# Altium schematic sheet GDRIVE1.SchDoc
size A3; PageSetup: Record=PageOptions|CenterHorizontal=True|CenterVertical=True|PrintScale=1.00|XCorrection=1.00|YCorrection=1.00|PrintKind=1|BorderSize=5000000|LeftOffset=0|BottomOffset=0|Orientation=2|PaperLength=1000|PaperWidth=1000|Scale=100|PaperSource=7|PrintQuality=-3|MediaType=1|DitherType=10|PrintScaleMode=1|PaperKind=A3|PaperIndex=8
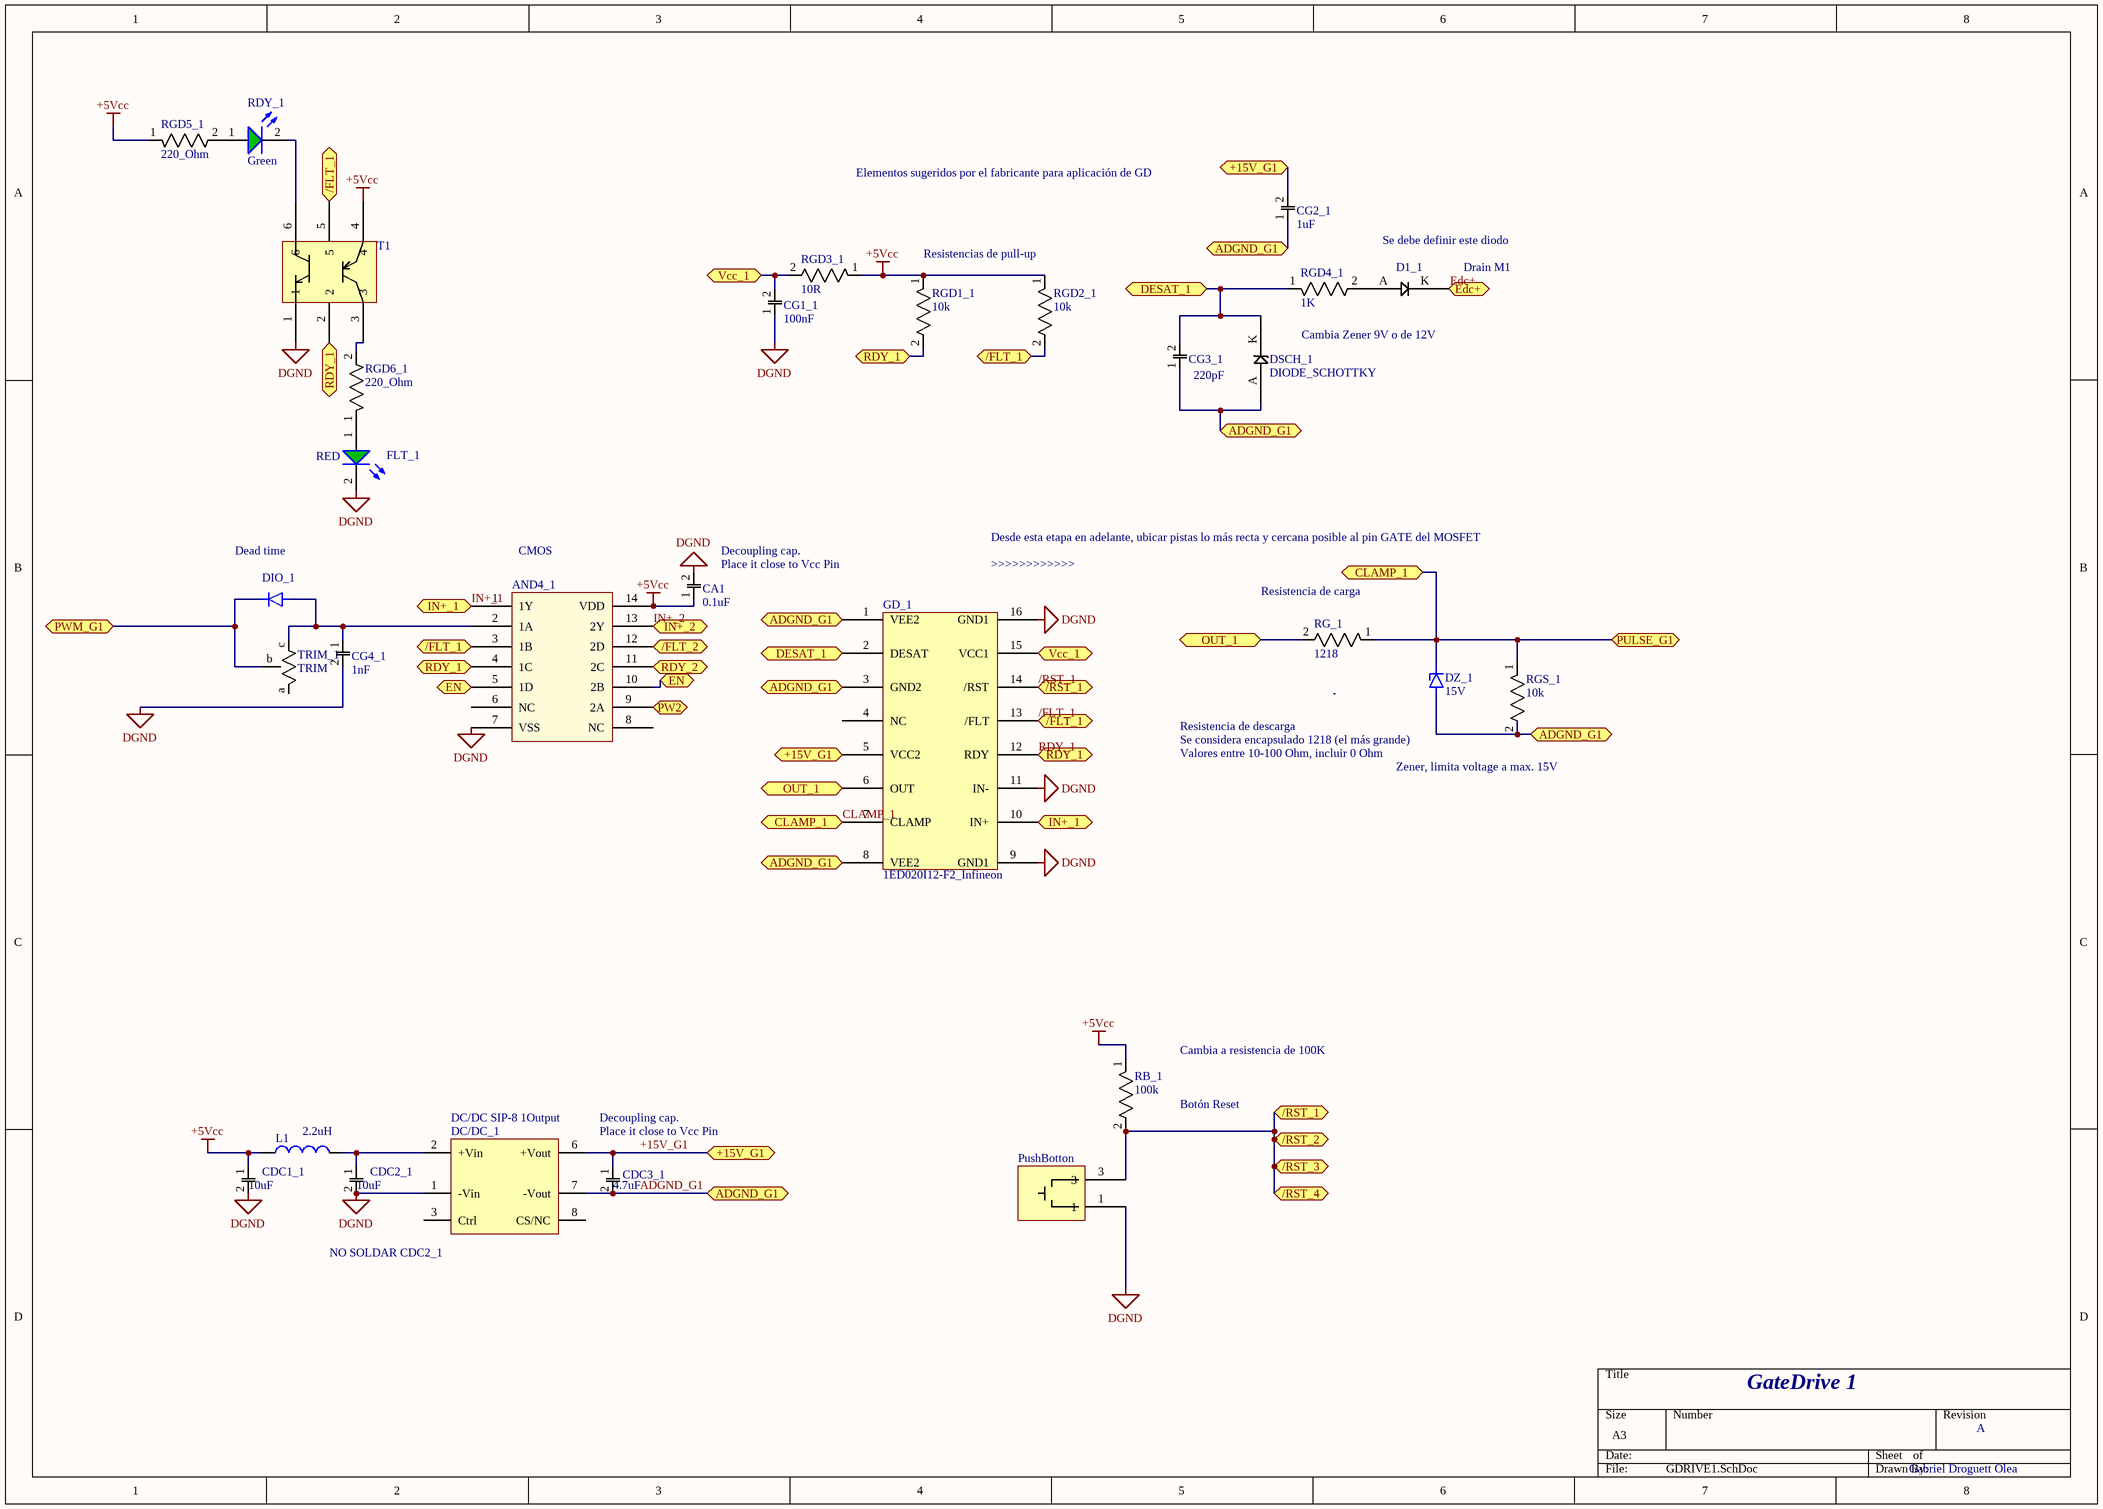
[diagram p0: GDRIVE1.SchDoc]

## Parts
AND4_1  AND_4_2  [SOIC-14]  (value not drawn)
CA1  0.1uF  [CAP_0603]
CDC1_1  10uF  [C1206]
CDC2_1  10uF  [C1206]
CDC3_1  4.7uF  [C1206]
CG1_1  100nF  [CAP_0805_L]
CG2_1  1uF  [CAP_0603]
CG3_1  220pF  [CAP_0603]
CG4_1  1nF  [CAP_0805]
D1_1  DIODE  [DO-214AC]  (value not drawn)
DC/DC_1  DC/DC SIP-8 1Output  [DC/DC SIP-8]
DIO_1  DIOde  [DIO_BAS85-GS08]  (value not drawn)
DSCH_1  DIODE_SCHOTTKY  [SOD323W]
DZ_1  15V  [BZV55-C15,115]
FLT_1  RED  [LED_0805]
GD_1  1ED020I12-F2_Infineon  [SOIC_16W]
L1  2.2uH  [RES_0805]
PushBotton  SWITCH PUSH SPST-NO  [SWITCH PUSH SPST-NO]  (value not drawn)
RB_1  100k  [0603]
RDY_1  Green  [LED_0805]
RG_1  1218  [RES_1218]
RGD1_1  10k  [0603]
RGD2_1  10k  [0603]
RGD3_1  10R  [RES_1206]
RGD4_1  1K  [RES_0805]
RGD5_1  220_Ohm  [res_0805]
RGD6_1  220_Ohm  [res_0805]
RGS_1  10k  [RES_1206]
T1  TRANS PREBIAS  [SOT363_]  (value not drawn)
TRIM_1  TRIM  [TRIM_TS53YJ203MR10]

## Ports
+15V_G1 (bidir), /FLT_1 (bidir), /FLT_2 (bidir), /RST_1 (bidir), /RST_2 (bidir), /RST_3 (bidir), /RST_4 (bidir), ADGND_G1 (bidir), CLAMP_1 (bidir), DESAT_1 (bidir), Edc+ (bidir), EN (bidir), IN+_1 (bidir), IN+_2 (bidir), OUT_1 (bidir), PULSE_G1 (bidir), PW2 (bidir), PWM_G1 (bidir), RDY_1 (bidir), RDY_2 (bidir), Vcc_1 (bidir)

## Nets
+5Vcc: AND4_1.14(VDD) CA1.1 CDC1_1.1 L1.1 RB_1.1(C) RGD1_1.1(C) RGD2_1.1(C) RGD3_1.1(C) RGD5_1.1(C) T1.4
DGND: AND4_1.7(VSS) CA1.2 CDC1_1.2 CDC2_1.2 CG1_1.1 CG4_1.2 DC/DC_1.1(-Vin) FLT_1.2(C) GD_1.9(GND1) GD_1.11(IN-) GD_1.16(GND1) PushBotton.1 T1.1
+15V_G1: CDC3_1.1 CG2_1.2 DC/DC_1.6(+Vout) GD_1.5(VCC2) ; port +15V_G1
/FLT_1: AND4_1.3(1B) GD_1.13(/FLT) RGD2_1.2(A) T1.5 ; port /FLT_1
/FLT_2: AND4_1.12(2D) ; port /FLT_2
/RST_1: GD_1.14(/RST) PushBotton.3 RB_1.2(A) ; port /RST_1, port /RST_2, port /RST_3, port /RST_4
ADGND_G1: CDC3_1.2 CG2_1.1 CG3_1.1 DC/DC_1.7(-Vout) DSCH_1.A DZ_1.2(Anodo) GD_1.1(VEE2) GD_1.3(GND2) GD_1.8(VEE2) RGS_1.2(A) ; port ADGND_G1
CLAMP_1: DZ_1.1(Catodo) GD_1.7(CLAMP) RG_1.1(C) RGS_1.1(C) ; port CLAMP_1, port PULSE_G1
DESAT_1: CG3_1.2 DSCH_1.K GD_1.2(DESAT) RGD4_1.1(C) ; port DESAT_1
Edc+: D1_1.K ; port Edc+
EN: AND4_1.5(1D) AND4_1.10(2B) ; port EN
IN+_1: AND4_1.1(1Y) GD_1.10(IN+) ; port IN+_1
IN+_2: AND4_1.13(2Y) ; port IN+_2
OUT_1: GD_1.6(OUT) RG_1.2(A) ; port OUT_1
PW2: AND4_1.9(2A) ; port PW2
PWM_G1: DIO_1.1(Catodo) TRIM_1.b ; port PWM_G1
RDY_1: AND4_1.4(1C) GD_1.12(RDY) RGD1_1.2(A) T1.2 ; port RDY_1
RDY_2: AND4_1.11(2C) ; port RDY_2
Vcc_1: CG1_1.2 GD_1.15(VCC1) RGD3_1.2(A) ; port Vcc_1
NetAND4_1_2: AND4_1.2(1A) CG4_1.1 DIO_1.2(Anodo) TRIM_1.c
NetCDC2_1_1: CDC2_1.1 DC/DC_1.2(+Vin) L1.2
NetD1_1_A: D1_1.A RGD4_1.2(A)
NetFLT_1_1: FLT_1.1(A) RGD6_1.1(C)
NetRDY_1_1: RDY_1.1(A) RGD5_1.2(A)
NetRDY_1_2: RDY_1.2(C) T1.6
NetRGD6_1_2: RGD6_1.2(A) T1.3

Not connected (* = marked no-connect by the designer): AND4_1 6(NC) 8(NC); DC/DC_1 3(Ctrl) 8(CS/NC); GD_1 4(NC); TRIM_1 a

## Notes on the sheet
- Elementos sugeridos por el fabricante para aplicación de GD
- Se debe definir este diodo
- Resistencias de pull-up
- Drain M1
- Cambia Zener 9V o de 12V
- (near DIO_1) Dead time
- (near AND4_1) CMOS
- (near CA1) Decoupling cap.
- Place it close to Vcc Pin
- Desde esta etapa en adelante, ubicar pistas lo más recta y cercana posible al pin GATE del MOSFET
- (near GD_1) >>>>>>>>>>>>
- (near RG_1) Resistencia de carga
- Resistencia de descarga
- Se considera encapsulado 1218 (el más grande)
- Valores entre 10-100 Ohm, incluir 0 Ohm
- (near RGS_1) Zener, limita voltage a max. 15V
- Cambia a resistencia de 100K
- Decoupling cap.
- Botón Reset
- (near DC/DC_1) NO SOLDAR CDC2_1
- GateDrive 1
- A
- Gabriel Droguett Olea
- Labels drawn without touching a wire or pin: Edc+

## Library data of the parts
AND4_1 = AND_4_2: IC GATE AND 2CH 4-INP 14-SO; Manufacturer Part Number: HEF4082BT,653; Digi-Key Part Number: 1727-6011-1-ND; RS Part Number: *
CA1 = CAP_0603YC104KAT2A: 0.1µF ±10% 16V Ceramic Capacitor X7R 0603 (1608 Metric); Digi-Key Part Number: 478-1239-1-ND; Manufacturer Part Number: 0603YC104KAT2A; RS Part Number: *
CDC1_1 CDC2_1 = CAP_C0805C105Z3VACTU: CAP CER 10UF 35V X6S 1206; Manufacturer Part Number: C3216X6S1V106K160AC; Digi-Key Part Number: 445-14778-1-ND; RS Part Number: 723-6647
CDC3_1 = CAP_C0805C105Z3VACTU: CAP CER 4.7UF 35V X7R 1206; Manufacturer Part Number: C3216X7R1V475K085AC; Digi-Key Part Number: 445-14805-1-ND; RS Part Number: *
CG1_1 = CAP_0603YC104KAT2A: CAP CER 0.1UF 50V X7R 0805; Manufacturer Part Number: 08055C104KAT2A; Digi-Key Part Number: 478-1395-1-ND; RS Part Number: *
CG2_1 = CAP_0603YC104KAT2A: CAP CER 1UF 50V X5R 0603; Manufacturer Part Number: CGA3E3X5R1H105K080AB; Digi-Key Part Number: 445-7878-1-ND; RS Part Number: *
CG3_1 = CAP_0603YC104KAT2A: CAP CER 220PF 50V C0G/NP0 0603; Manufacturer Part Number: C0603C221F5GACTU; Digi-Key Part Number: 399-7876-1-ND; RS Part Number: *
CG4_1 = CAP_C0805C102J5GACTU: CAP CER 1000PF 50V C0G/NP0 0805; Digi-Key Part Number: 399-1136-1-ND; Manufacturer Part Number: C0805C102J5GACTU; RS Part Number: *
D1_1 = DIODE: DIODE GEN PURP 1KV 1A SMA; Manufacturer Part Number: RS1MTR; Digi-Key Part Number: 1655-1501-1-ND; RS Part Number: *
DIO_1 = DIO_BAS85-GS08: DIODE SCHOTTKY 30V 200MA SOD80; Digi-Key Part Number: BAS85-GS08CT-ND; Manufacturer Part Number: BAS85-GS08; RS Part Number: *
DSCH_1 = DIODE_SCHOTTKY: DIODE SCHOTTKY 30V 200MA SOT23-3; Manufacturer Part Number: BAT54-7-F; Digi-Key Part Number: BAT54-FDICT-ND; RS Part Number: *
DZ_1 = DIO_BZV55-C15,115: DIODE ZENER 15V 500MW SOD80C; Digi-Key Part Number: 1727-4962-1-ND; Manufacturer Part Number: BZV55-C15,115; RS Part Number: 484-3227
FLT_1 = WL-SMCW 0805  150080GS75000: LED RED CLEAR 0805 SMD; Manufacturer Part Number: 150080RS75000; Digi-Key Part Number: 732-4984-1-ND; RS Part Number: 815-4225
GD_1 = 1ED020I12-F2_Infineon: IC IGBT DVR 1200V 2A DSO16; Manufacturer Part Number: 1ED020I12F2XUMA1; Digi-Key Part Number: 1ED020I12F2XUMA1CT-ND; RS Part Number: 110-9111
L1 = Inductor: FIXED IND 2.2UH 600MA 160 MOHM; Manufacturer Part Number: MLZ2012M2R2HT000; Digi-key Part Number: 445-8658-1-ND; RS Part Number: *
PushBotton = SWITCH PUSH SPST-NO: SWITCH PUSH SPST-NO 0.4VA 20V; Manufacturer Part Number: 800BWSP9SM6RE; Digi-Key Part Number: EG2610CT-ND; RS Part Number: *
RB_1 = RES_RCL121847R0JNEK: RES SMD 100K OHM 1% 1/4W 0603; Manufacturer Part Number: CRCW0603100KFKEAHP; Digi-Key Part Number: 541-100KSCT-ND; RS Part Number: *
RDY_1 = WL-SMCW 0805  150080GS75000: LED RED CLEAR 0805 SMD; Manufacturer Part Number: 150080VS75000; Digi-Key Part Number: 732-4986-1-ND
RG_1 = RES_RCL121847R0JNEK: RON 1218; Digi-Key Part Number: *; Manufacturer Part Number: *; RS Part Number: *
RGD1_1 RGD2_1 = RES_RCL121847R0JNEK: RES SMD 10K OHM 0.1% 3/8W 0603; Manufacturer Part Number: PHP00603E1002BST1; Digi-Key Part Number: 764-1103-6-ND; RS Part Number: 818-3052
RGD3_1 = RES_RCL121847R0JNEK: RES SMD 10 OHM 1W 1206 WIDE; Manufacturer Part Number: PRG3216P-10R0-D-T5; Digi-Key Part Number: 408-1809-1-ND; RS Part Number: *
RGD4_1 = RES_RCL121847R0JNEK: RES SMD 1K OHM 0.1% 1W 0805; Manufacturer Part Number: PCAN0805E1001BST5; Digi-Key Part Number: 764-1240-6-ND; RS Part Number: *
RGD5_1 RGD6_1 = RES_ERJ-3GEYJ471V: 1% 1/4W 0805; Manufacturer Part Number: RC0603FR-07220RL; Digi-Key Part Number: 311-220HRCT-ND; RS Part Number: *
RGS_1 = RES_ERJ-8ENF2002V: RES SMD 10K OHM 0-1% 1W 1206; Manufacturer Part Number: PHP01206E1002BST5; Digi-Key Part Number: PHP10.0KADKR_ND; RS Part Number: *
T1 = TRANS PREBIAS: TRANS PREBIAS NPN/PNP SOT666; Manufacturer Part Number: PUMD16,115; Digi-Key Part Number: 1727-3930-1-ND; RS Part Number: 518-3734
TRIM_1 = TRIM_TS53YJ203MR10: TRIMMER 1K OHM 0.25W SMD; Manufacturer Part Number: TS53YJ102MR10; Digi-Key Part Number: TS53YJ-1.0KCT-ND